# Altium schematic sheet Buzzer.SchDoc: Smart Bus Ticketing Machine/Outputs/Buzzer
size A; ApprovedBy: Kiran Gunathilaka; CheckedBy: Kiran Gunathilaka; Author: Kiran Gunathilaka; CompanyName: Kiran Gunathilaka; DrawnBy: Kiran Gunathilaka; Engineer: Kiran Gunathilaka; DocumentNumber: 09; Revision: v1.2; SheetNumber: 9; SheetTotal: 11
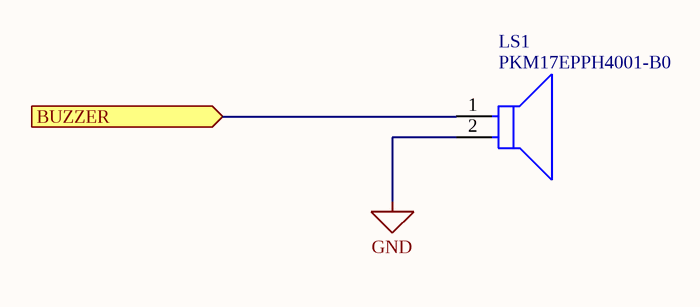
[diagram p0: Buzzer.SchDoc]

## Parts
LS1  PKM17EPPH4001-B0  [FP-PKM17EPPH4001-B0-MFG]

## Ports
BUZZER (in, see Outputs[3B], MCU[4A], Outputs[2B])

## Nets
GND: LS1.2
BUZZER: LS1.1 ; port BUZZER

## Library data of the parts
LS1 = CMP-06202-000027-1: AUDIO PIEZO TRANSDUCER 25V TH; Capacitance: 7nF; Self Resonant Frequency: 4kHz; Voltage Rating: 3V; Washable: No; Package Quantity: 600; Height: 7mm; Radiation Hardening: No; Lead Free: Lead Free; Max Operating Temperature: 70°C; REACH SVHC: No SVHC; Packaging: Bulk; Min Operating Temperature: -20°C; Diameter: 17mm; Voltage Rating (DC): 25V; Max Frequency: 4kHz; Nominal Input Voltage: 3V; Mount: Through Hole; Max Supply Voltage: 25V; Frequency: 4kHz; Termination: Solder